# EAGLE design chipdesign2018 (EAGLE 7.3.0)

## Sheet 1 of 2
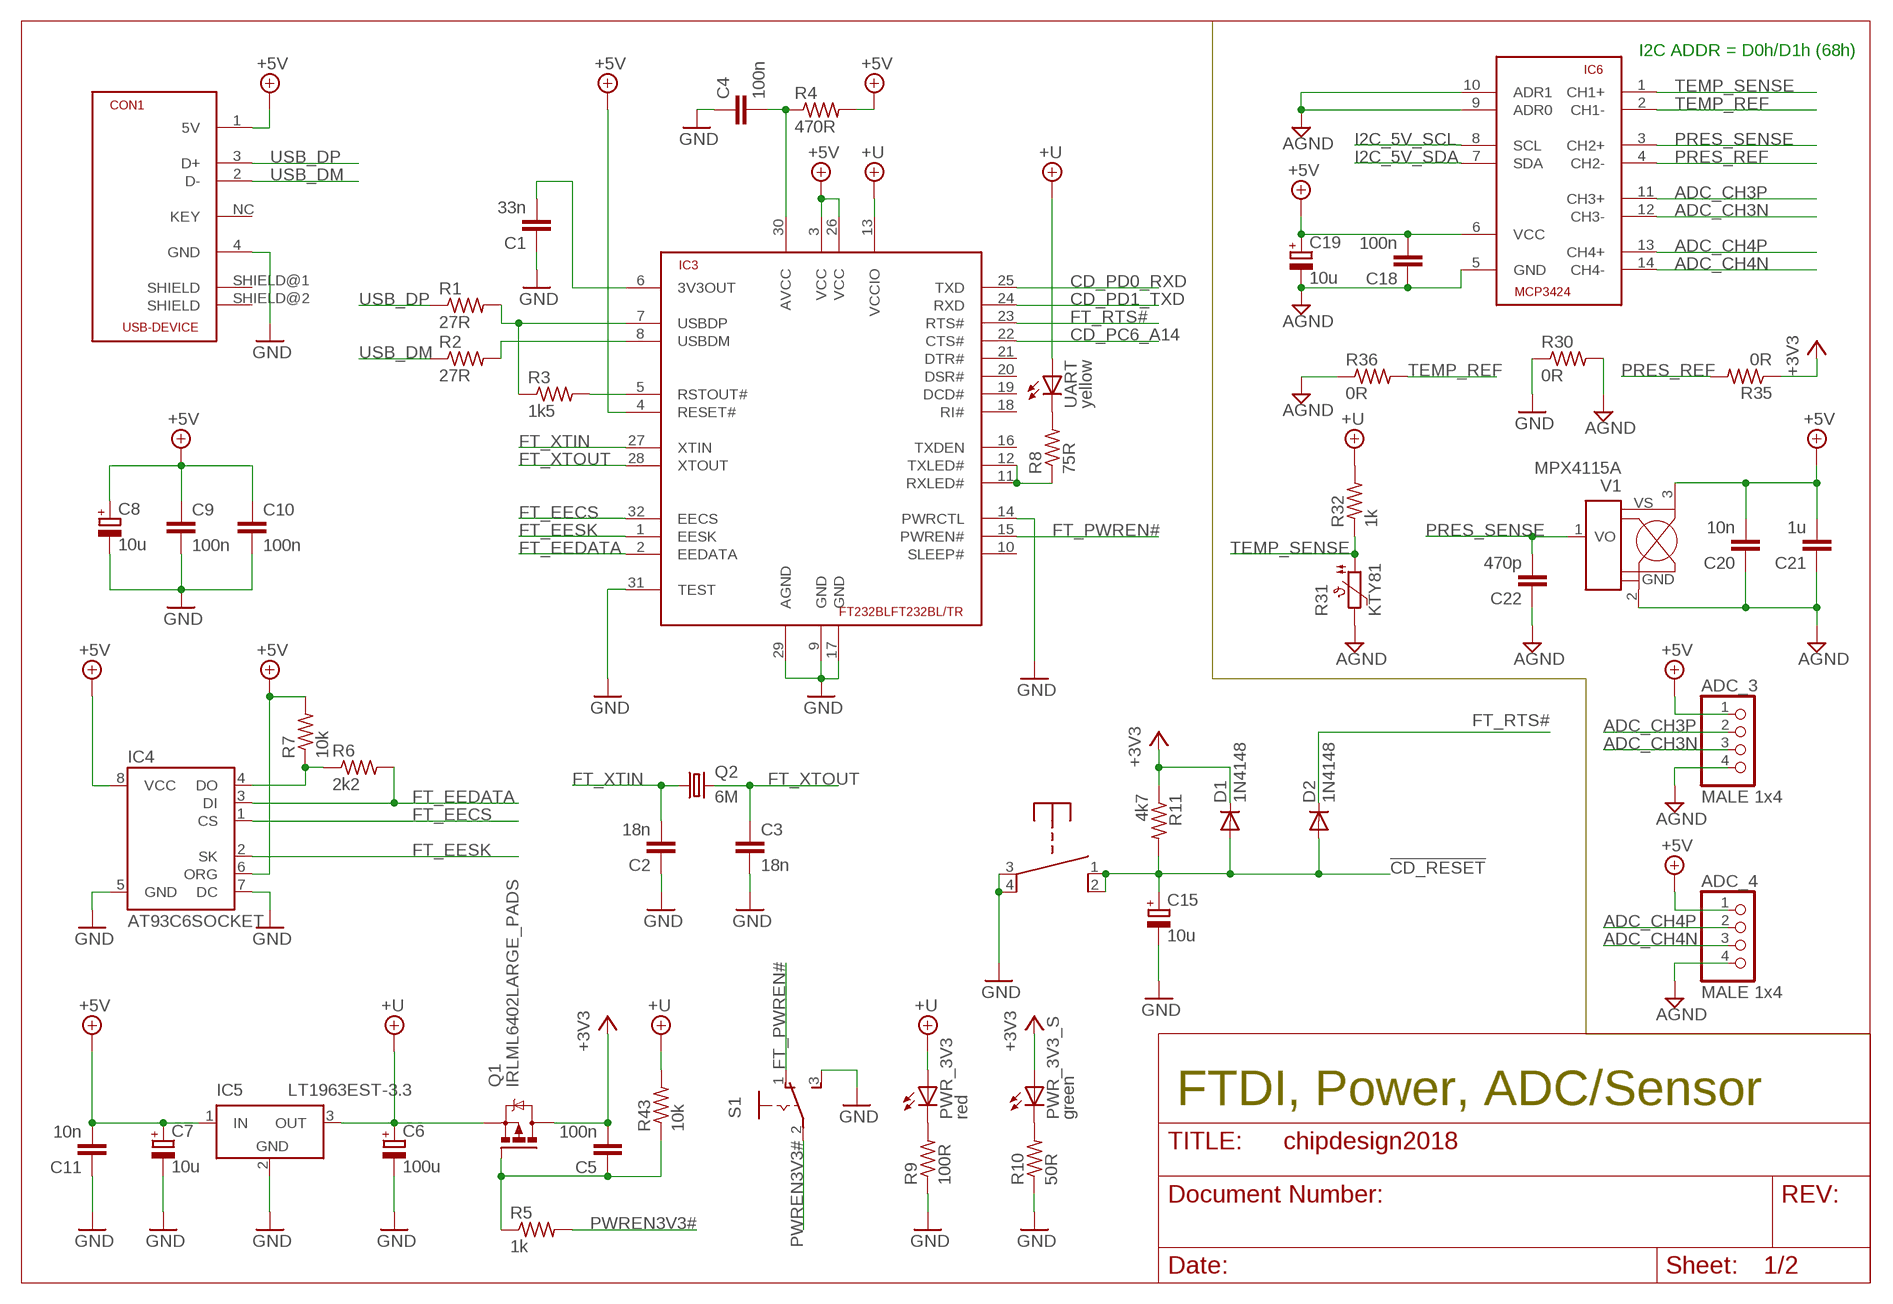
[diagram p0: schematic, sheet 1]

### Parts
ADC_3  MALE 1x4  PINHD-1X4  [1X04]
ADC_4  MALE 1x4  PINHD-1X4  [1X04]
C1  33n  C-EU025-025X050  [C025-025X050]
C2  18n  C-EU025-025X050  [C025-025X050]
C3  18n  C-EU025-025X050  [C025-025X050]
C4  100n  C-EU025-025X050  [C025-025X050]
C5  100n  C-EU025-025X050  [C025-025X050]
C6  100u  CPOL-EUE2.5-6  [E2,5-6]
C7  10u  CPOL-EUE2-5  [E2-5]
C8  10u  CPOL-EUE2-5  [E2-5]
C9  100n  C-EU025-025X050  [C025-025X050]
C10  100n  C-EU025-025X050  [C025-025X050]
C11  10n  C-EU025-025X050  [C025-025X050]
C15  10u  CPOL-EUE2-5  [E2-5]
C18  100n  C-EU025-025X050  [C025-025X050]
C19  10u  CPOL-EUE2-5  [E2-5]
C20  10n  C-EU025-025X050  [C025-025X050]
C21  1u  C-EU025-025X050  [C025-025X050]
C22  470p  C-EU025-025X050  [C025-025X050]
CON1  USB-DEVICE  [USB-B]
D1  1N4148  1N4148DO35-7  [DO35-7]
D2  1N4148  1N4148DO35-7  [DO35-7]
IC3  FT232BLFT232BL/TR  [LQFP-32]
IC4  AT93C6SOCKET  [SOCKET-08]
IC5  LT1963EST-3.3  [SOT223]
IC6  MCP3424  [SO-14]
PWR_3V3  red  LED3MM  [LED3MM]
PWR_3V3_S  green  LED3MM  [LED3MM]
Q1  IRLML6402LARGE_PADS  [SOT23W_INFINEON]
Q2  6M  CRYSTALHC49S  [HC49/S]
R1  27R  R-US_0207/7  [0207/7]
R2  27R  R-US_0207/7  [0207/7]
R3  1k5  R-US_0207/7  [0207/7]
R4  470R  R-US_0207/7  [0207/7]
R5  1k  R-US_0207/7  [0207/7]
R6  2k2  R-US_0207/7  [0207/7]
R7  10k  R-US_0207/7  [0207/7]
R8  75R  R-US_0207/7  [0207/7]
R9  100R  R-US_0207/7  [0207/7]
R10  50R  R-US_0207/7  [0207/7]
R11  4k7  R-US_0207/7  [0207/7]
R30  0R  R-US_0207/7  [0207/7]
R31  KTY81  PTC-SOD70  [SOD70]
R32  1k  R-US_0207/7  [0207/7]
R35  0R  R-US_0207/7  [0207/7]
R36  0R  R-US_0207/7  [0207/7]
R43  10k  R-US_0207/7  [0207/7]
S1  255SB  [255SB]
U$1  PHAP3301  [PHAP3301]
UART  yellow  LED3MM  [LED3MM]
V1  MPX4115A  MPX4250A  [MPX_CASE867]

### Nets
!CD_RESET: C15.+ D1.A D2.A R11.2 U$1.1 U$1.2 ; also sheet 2
+3V3: C5.2 D1.C PWR_3V3_S.A Q1.3(D) R11.1 R35.1 ; also sheet 2
+5V: ADC_3.1 ADC_4.1 C7.+ C8.+ C9.1 C10.1 C11.2 C18.2 C19.+ C20.2 C21.2 CON1.1(5V) IC3.3(VCC) IC3.4(RESET#) IC3.26(VCC) IC4.6(ORG) IC4.8(VCC) IC5.1(IN) IC6.6(VCC) R4.2 R7.2 V1.3(VS) ; also sheet 2
+UB: C6.+ IC3.13(VCCIO) IC5.3(OUT) PWR_3V3.A Q1.2(S) R32.2 R43.2 UART.A ; supply symbol labelled +U
ADC_CH3N: ADC_3.3 IC6.12(CH3-)
ADC_CH3P: ADC_3.2 IC6.11(CH3+)
ADC_CH4N: ADC_4.3 IC6.14(CH4-)
ADC_CH4P: ADC_4.2 IC6.13(CH4+)
AGND: ADC_3.4 ADC_4.4 C18.1 C19.- C20.1 C21.1 C22.1 IC6.5(GND) IC6.9(ADR0) IC6.10(ADR1) R30.2 R31.2 R36.1 V1.2(GND)
CD_PC6_A14: IC3.22(CTS#) ; also sheet 2
CD_PD0_RXD: IC3.25(TXD) ; also sheet 2
CD_PD1_TXD: IC3.24(RXD) ; also sheet 2
EEDO: IC4.4(DO) R6.1 R7.1
EN3V3#: C5.1 Q1.1(G) R5.1 R43.1
FT_3V3OUT: C1.2 IC3.6(3V3OUT)
FT_ACTLED#: IC3.11(RXLED#) IC3.12(TXLED#) R8.1
FT_AVCC: C4.2 IC3.30(AVCC) R4.1
FT_EECS: IC3.32(EECS) IC4.1(CS)
FT_EEDATA: IC3.2(EEDATA) IC4.3(DI) R6.2
FT_EESK: IC3.1(EESK) IC4.2(SK)
FT_PWREN#: IC3.15(PWREN#) S1.1(O)
FT_RSTOUT#: IC3.5(RSTOUT#) R3.2
FT_RTS#: D2.C IC3.23(RTS#)
FT_USBDM: IC3.8(USBDM) R2.2
FT_USBDP: IC3.7(USBDP) R1.2 R3.1
FT_XTIN: C2.2 IC3.27(XTIN) Q2.1
FT_XTOUT: C3.1 IC3.28(XTOUT) Q2.2
GND: C1.1 C2.1 C3.2 C4.1 C6.- C7.- C8.- C9.2 C10.2 C11.1 C15.- CON1.4(GND) IC3.9(GND) IC3.14(PWRCTL) IC3.17(GND) IC3.29(AGND) IC3.31(TEST) IC4.5(GND) IC4.7(DC) IC5.2(GND) R9.1 R10.1 R30.1 S1.3(S) U$1.3 U$1.4 ; also sheet 2
I2C_5V_SCL: IC6.8(SCL) ; also sheet 2
I2C_5V_SDA: IC6.7(SDA) ; also sheet 2
N$3: R8.2 UART.K(C)
N$4: PWR_3V3.K(C) R9.2
N$5: PWR_3V3_S.K(C) R10.2
PRES_REF: IC6.4(CH2-) R35.2
PRES_SENSE: C22.2 IC6.3(CH2+) V1.1(VO+)
PWREN3V3#: R5.2 S1.2(P)
TEMP_REF: IC6.2(CH1-) R36.2
TEMP_SENSE: IC6.1(CH1+) R31.1 R32.1
USB_DM: CON1.2(D-) R2.1
USB_DP: CON1.3(D+) R1.1
Unconnected: CON1.NC(KEY) CON1.SHIELD@1(SHIELD) CON1.SHIELD@2(SHIELD) IC3.10(SLEEP#) IC3.16(TXDEN) IC3.18(RI#) IC3.19(DCD#) IC3.20(DSR#) IC3.21(DTR#)

### Notes on the sheet
- I2C ADDR = D0h/D1h (68h)
- FTDI, Power, ADC/Sensor

## Sheet 2 of 2
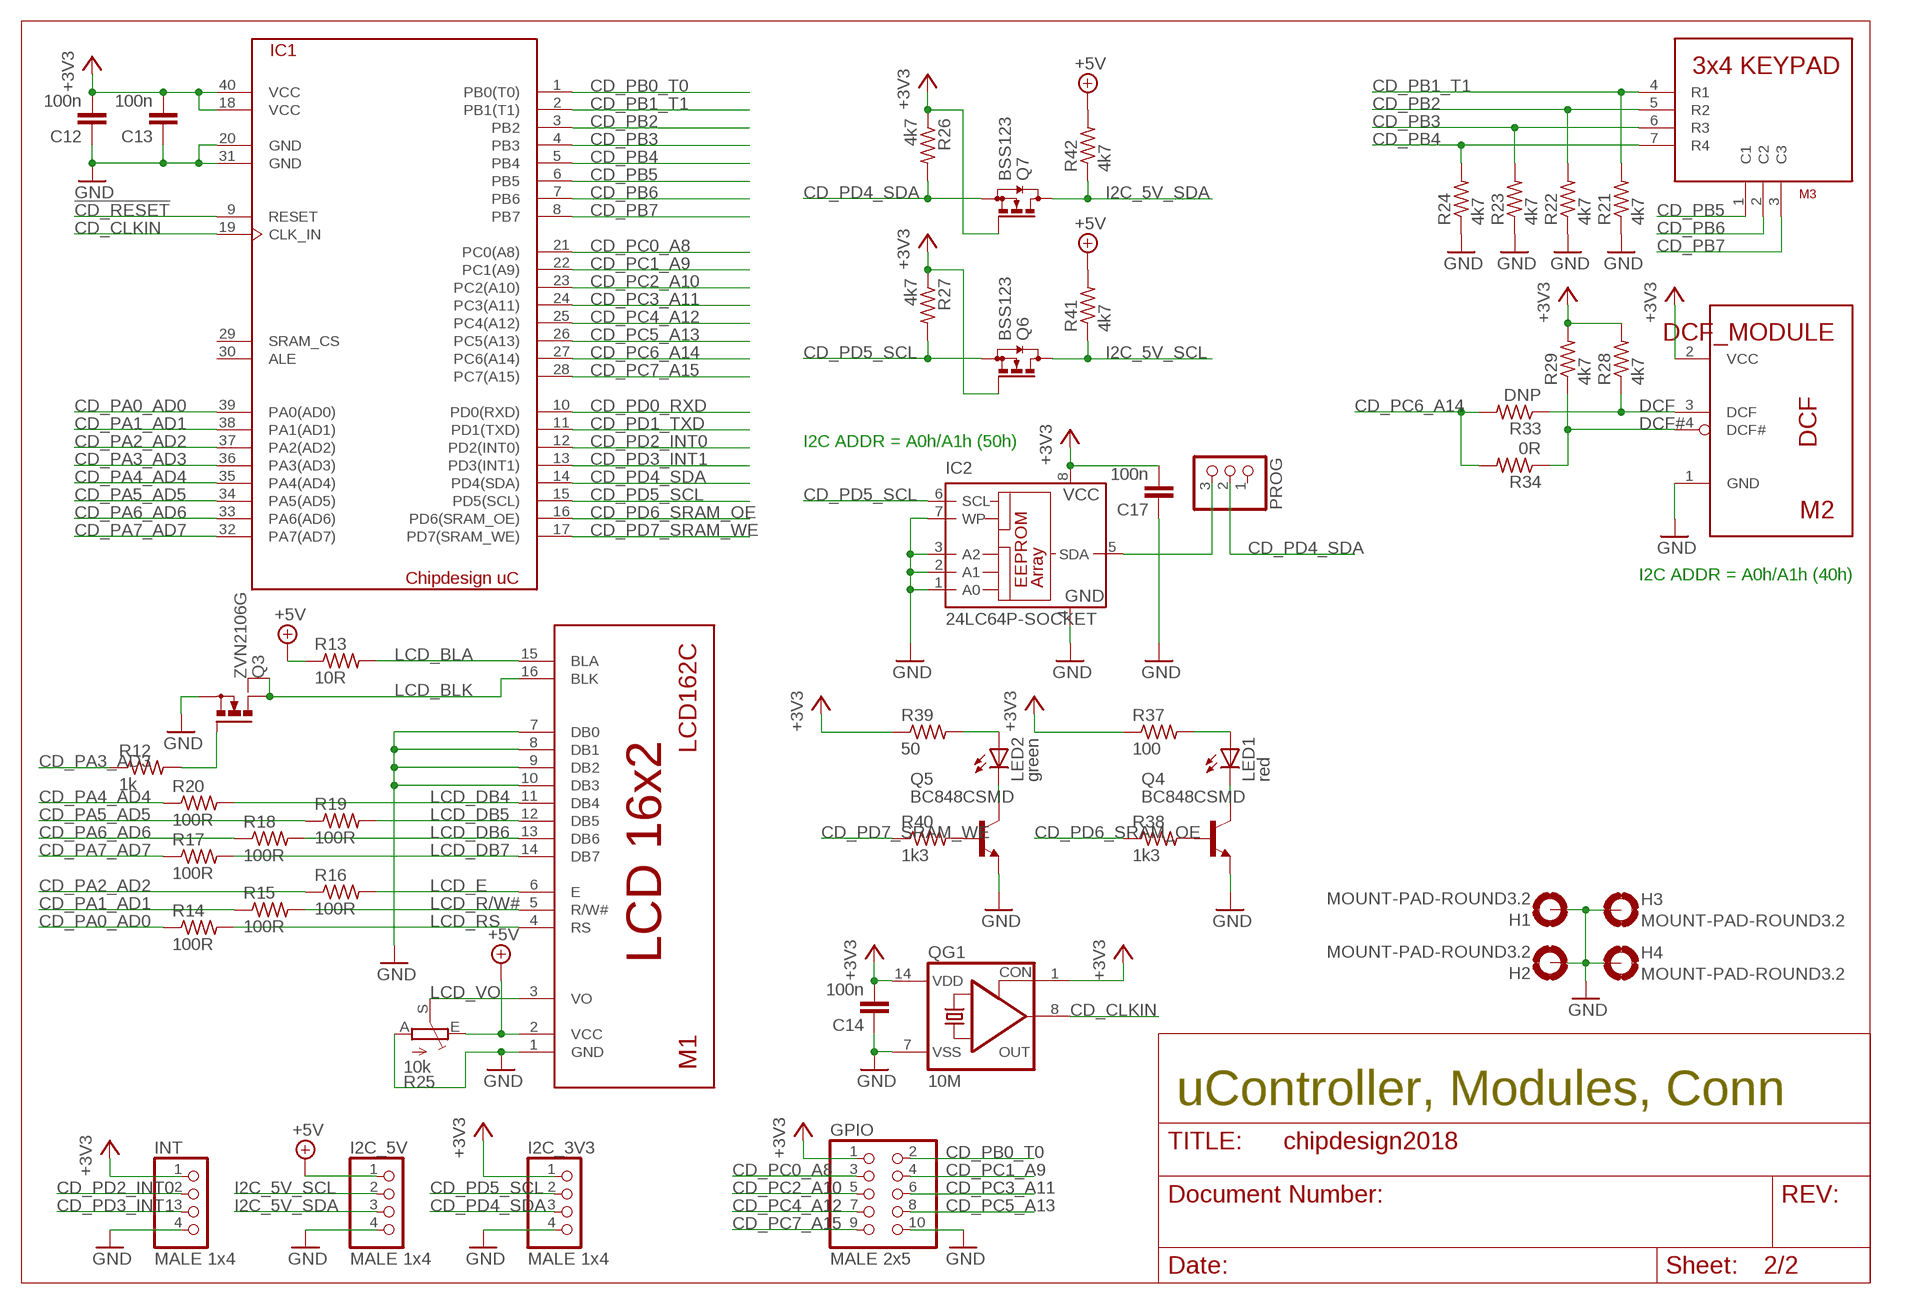
[diagram p1: schematic, sheet 2]

### Parts
C12  100n  C-EU025-025X050  [C025-025X050]
C13  100n  C-EU025-025X050  [C025-025X050]
C14  100n  C-EU025-025X050  [C025-025X050]
C17  100n  C-EU025-025X050  [C025-025X050]
GPIO  MALE 2x5  PINHD-2X5  [2X05]
H1  MOUNT-PAD-ROUND3.2  [3,2-PAD]
H2  MOUNT-PAD-ROUND3.2  [3,2-PAD]
H3  MOUNT-PAD-ROUND3.2  [3,2-PAD]
H4  MOUNT-PAD-ROUND3.2  [3,2-PAD]
I2C_3V3  MALE 1x4  PINHD-1X4  [1X04]
I2C_5V  MALE 1x4  PINHD-1X4  [1X04]
IC1  Chipdesign uC  CHIPDESIGN_UC  [FPGA-BOARD-2X20]
IC2  24LC64P-SOCKET  [SOCKET-08]
INT  MALE 1x4  PINHD-1X4  [1X04]
LED1  red  LED3MM  [LED3MM]
LED2  green  LED3MM  [LED3MM]
M1  LCD162C  [LCD162C]
M2  DCF_MODULE  [DCF_MODULE]
M3  KEYPAD  [KEYPAD]
PROG  PINHD-1X3  [1X03]
Q3  ZVN2106G  [SOT223]
Q4  BC848CSMD  [SOT23]
Q5  BC848CSMD  [SOT23]
Q6  BSS123  [SOT23]
Q7  BSS123  [SOT23]
QG1  10M  CRYSTAL_RES-SG51  [SG51]
R12  1k  R-US_0207/7  [0207/7]
R13  10R  R-US_0207/7  [0207/7]
R14  100R  R-US_0207/7  [0207/7]
R15  100R  R-US_0207/7  [0207/7]
R16  100R  R-US_0207/7  [0207/7]
R17  100R  R-US_0207/7  [0207/7]
R18  100R  R-US_0207/7  [0207/7]
R19  100R  R-US_0207/7  [0207/7]
R20  100R  R-US_0207/7  [0207/7]
R21  4k7  R-US_0207/7  [0207/7]
R22  4k7  R-US_0207/7  [0207/7]
R23  4k7  R-US_0207/7  [0207/7]
R24  4k7  R-US_0207/7  [0207/7]
R25  10k  TRIM_EU-  [ST6]
R26  4k7  R-US_0207/7  [0207/7]
R27  4k7  R-US_0207/7  [0207/7]
R28  4k7  R-US_0207/7  [0207/7]
R29  4k7  R-US_0207/7  [0207/7]
R33  DNP  R-US_0207/7  [0207/7]
R34  0R  R-US_0207/7  [0207/7]
R37  100  R-US_0207/7  [0207/7]
R38  1k3  R-US_0207/7  [0207/7]
R39  50  R-US_0207/7  [0207/7]
R40  1k3  R-US_0207/7  [0207/7]
R41  4k7  R-US_0207/7  [0207/7]
R42  4k7  R-US_0207/7  [0207/7]

### Nets
!CD_RESET: IC1.9(RESET) ; also sheet 1
+3V3: C12.2 C13.2 C14.2 C17.2 GPIO.1 I2C_3V3.1 IC1.18(VCC) IC1.40(VCC) IC2.8(VCC) INT.1 M2.2(VCC) Q6.1(G) Q7.1(G) QG1.1(CON) QG1.14(VDD) R26.1 R27.1 R28.2 R29.2 R37.1 R39.1 ; also sheet 1
+5V: I2C_5V.1 M1.2(VCC) R13.1 R25.E R41.2 R42.2 ; also sheet 1
CD_CLKIN: IC1.19(CLK_IN) QG1.8(OUT)
CD_PA0_AD0: IC1.39(PA0(AD0)) R14.1
CD_PA1_AD1: IC1.38(PA1(AD1)) R15.1
CD_PA2_AD2: IC1.37(PA2(AD2)) R16.1
CD_PA3_AD3: IC1.36(PA3(AD3)) R12.1
CD_PA4_AD4: IC1.35(PA4(AD4)) R20.1
CD_PA5_AD5: IC1.34(PA5(AD5)) R19.1
CD_PA6_AD6: IC1.33(PA6(AD6)) R18.1
CD_PA7_AD7: IC1.32(PA7(AD7)) R17.1
CD_PB0_T0: GPIO.2 IC1.1(PB0(T0))
CD_PB1_T1: IC1.2(PB1(T1)) M3.4(R1) R21.2
CD_PB2: IC1.3(PB2) M3.5(R2) R22.2
CD_PB3: IC1.4(PB3) M3.6(R3) R23.2
CD_PB4: IC1.5(PB4) M3.7(R4) R24.2
CD_PB5: IC1.6(PB5) M3.1(C1)
CD_PB6: IC1.7(PB6) M3.2(C2)
CD_PB7: IC1.8(PB7) M3.3(C3)
CD_PC0_A8: GPIO.3 IC1.21(PC0(A8))
CD_PC1_A9: GPIO.4 IC1.22(PC1(A9))
CD_PC2_A10: GPIO.5 IC1.23(PC2(A10))
CD_PC3_A11: GPIO.6 IC1.24(PC3(A11))
CD_PC4_A12: GPIO.7 IC1.25(PC4(A12))
CD_PC5_A13: GPIO.8 IC1.26(PC5(A13))
CD_PC6_A14: IC1.27(PC6(A14)) R33.2 R34.2 ; also sheet 1
CD_PC7_A15: GPIO.9 IC1.28(PC7(A15))
CD_PD0_RXD: IC1.10(PD0(RXD)) ; also sheet 1
CD_PD1_TXD: IC1.11(PD1(TXD)) ; also sheet 1
CD_PD2_INT0: IC1.12(PD2(INT0)) INT.2
CD_PD3_INT1: IC1.13(PD3(INT1)) INT.3
CD_PD4_SDA: I2C_3V3.3 IC1.14(PD4(SDA)) PROG.2 Q7.2(S) R26.2
CD_PD5_SCL: I2C_3V3.2 IC1.15(PD5(SCL)) IC2.6(SCL) Q6.2(S) R27.2
CD_PD6_SRAM_OE: IC1.16(PD6(SRAM_OE)) R38.1
CD_PD7_SRAM_WE: IC1.17(PD7(SRAM_WE)) R40.1
DCF: M2.3(DCF) R28.1 R33.1
DCF#: M2.4(DCF#) R29.1 R34.1
EEP_SDA: IC2.5(SDA) PROG.3
GND: C12.1 C13.1 C14.1 C17.1 GPIO.10 H1.B3,2(MOUNT) H2.B3,2(MOUNT) H3.B3,2(MOUNT) H4.B3,2(MOUNT) I2C_3V3.4 I2C_5V.4 IC1.20(GND) IC1.31(GND) IC2.1(A0) IC2.2(A1) IC2.3(A2) IC2.4(GND) IC2.7(WP) INT.4 M1.1(GND) M1.7(DB0) M1.8(DB1) M1.9(DB2) M1.10(DB3) M2.1(GND) Q3.3(S) Q4.2(E) Q5.2(E) QG1.7(VSS) R21.1 R22.1 R23.1 R24.1 R25.A ; also sheet 1
I2C_5V_SCL: I2C_5V.2 Q6.3(D) R41.1 ; also sheet 1
I2C_5V_SDA: I2C_5V.3 Q7.3(D) R42.1 ; also sheet 1
LCD_BLA: M1.15(BLA) R13.2
LCD_BLK: M1.16(BLK) Q3.2(D) Q3.4(D)
LCD_DB4: M1.11(DB4) R20.2
LCD_DB5: M1.12(DB5) R19.2
LCD_DB6: M1.13(DB6) R18.2
LCD_DB7: M1.14(DB7) R17.2
LCD_E: M1.6(E) R16.2
LCD_R/W#: M1.5(R/W#) R15.2
LCD_RS: M1.4(RS) R14.2
LCD_VO: M1.3(VO) R25.S
N$1: Q4.1(B) R38.2
N$2: LED1.K(C) Q4.3(C)
N$6: LED1.A R37.2
N$7: Q5.1(B) R40.2
N$8: Q3.1(G) R12.2
N$9: LED2.K(C) Q5.3(C)
N$10: LED2.A R39.2
Unconnected: IC1.29(SRAM_CS) IC1.30(ALE) PROG.1

### Notes on the sheet
- I2C ADDR = A0h/A1h (50h)
- I2C ADDR = A0h/A1h (40h)
- uController, Modules, Conn

## Power pins joined to a net without a drawn wire
GND: IC5.4(GND)

## Library data of the parts
ADC_3 ADC_4 I2C_3V3 I2C_5V INT = pinhead:PINHD-1X4: PIN HEADER
C1-C5 C9-C14 C17 C18 C20-C22 = rcl:C-EU: CAPACITOR, European symbol
C6-C8 C15 C19 = rcl:CPOL-EU: POLARIZED CAPACITOR, European symbol
CON1 = chipdesign2016_ref:USB-DEVICE
D1 D2 = diode:1N4148: DIODE high speed (Philips)
GPIO = pinhead:PINHD-2X5: PIN HEADER
H1-H4 = holes:MOUNT-PAD-ROUND: MOUNTING PAD, round
IC1 = chipdesign2016_ref:CHIPDESIGN_UC
IC2 = chipdesign2016_ref:24*: Serial EEPROM I2C; MF: MICROCHIP; MPN: 24LC64-I/P; OC_FARNELL: 9758054; OC_NEWARK: 62K0584
IC3 = chipdesign2016_ref:FT232BL
IC4 = chipdesign2016_ref:AT93C*6: 3-wire serial EEPROM
IC5 = linear-technology:LT1963EST: 1.5A, Low Noise, Fast Transient Response LDO Regulator Source: http://www.linear.com/pc/downloadDocument.do?navId=H0,C3,P2222,D3148; MPN: LT1963EST-3.3; OC_FARNELL: 1501032; OC_NEWARK: 57M7546
IC6 = chipdesign2016_ref:MCP3424
LED1 LED2 PWR_3V3 PWR_3V3_S UART = led:LED: LED OSRAM: - CHIPLED LG R971, LG N971, LY N971, LG Q971, LY Q971, LO R971, LY R971 LH N974, LH R974 LS Q976, LO Q976, LY Q976 LO Q996 - Hyper CHIPLED LW Q18S LB Q993, LB Q99A, LB R99A - SideLED LS A670, LO A670, LY A670, LG A670, LP A670 LB A673, LV A673, LT A673, LW A673 LH A674 LY A675 LS A676, LA A676, LO A676, LY A676, LW A676 LS A679, LY A679, LG A679 - Hyper Micro SIDELED® LS Y876, LA Y876, LO Y876, LY Y876 LT Y87S - SmartLED LW L88C, LW L88S LB L89C, LB L89S, LG L890 LS L89K, LO L89K, LY L89K LS L896, LA L896, LO L896, LY L896 - TOPLED LS T670, LO T670, LY T670, LG T670, LP T670 LSG T670, LSP T670, LSY T670, LOP T670, LYG T670 LG T671, LOG T671, LSG T671 LB T673, LV T673, LT T673, LW T673 LH T674 LS T676, LA T676, LO T676, LY T676, LB T676, LH T676, LSB T676, LW T676 LB T67C, LV T67C, LT T67C, LS T67K, LO T67K, LY T67K, LW E67C LS E67B, LA E67B, LO E67B, LY E67B, LB E67C, LV E67C, LT E67C LW T67C LS T679, LY T679, LG T679 LS T770, LO T770, LY T770, LG T770, LP T770 LB T773, LV T773, LT T773, LW T773 LH T774 LS E675, LA E675, LY E675, LS T675 LS T776, LA T776, LO T776, LY T776, LB T776 LHGB T686 LT T68C, LB T68C - Hyper Mini TOPLED® LB M676 - Mini TOPLED Santana® LG M470 LS M47K, LO M47K, LY M47K Source: http://www.osram.convergy.de LUXEON: - LUMILED® LXK2-PW12-R00, LXK2-PW12-S00, LXK2-PW14-U00, LXK2-PW14-V00 LXK2-PM12-R00, LXK2-PM12-S00, LXK2-PM14-U00 LXK2-PE12-Q00, LXK2-PE12-R00, LXK2-PE12-S00, LXK2-PE14-T00, LXK2-PE14-U00 LXK2-PB12-K00, LXK2-PB12-L00, LXK2-PB12-M00, LXK2-PB14-N00, LXK2-PB14-P00, LXK2-PB14-Q00 LXK2-PR12-L00, LXK2-PR12-M00, LXK2-PR14-Q00, LXK2-PR14-R00 LXK2-PD12-Q00, LXK2-PD12-R00, LXK2-PD12-S00 LXK2-PH12-R00, LXK2-PH12-S00 LXK2-PL12-P00, LXK2-PL12-Q00, LXK2-PL12-R00 Source: www.luxeon.com KINGBRIGHT: KA-3528ASYC Source: www.kingbright.com
M1 = chipdesign2016_ref:LCD162C
M2 = chipdesign2016_ref:DCF_MODULE
M3 = chipdesign2016_ref:KEYPAD
PROG = pinhead:PINHD-1X3: PIN HEADER
Q1 = chipdesign2016_ref:IRLML6402: HEXFET P-Channel Power MOSFET
Q2 = chipdesign2016_ref:CRYSTAL: CRYSTAL; OC_FARNELL: 1667008; OC_NEWARK: unknown
Q3 = chipdesign2016_ref:ZVN2106G: Power MOSFET N-Channel
Q4 Q5 = transistor-npn:BC848*: NPN Transistor
Q6 Q7 = transistor-small-signal:BSS123: N-CHANNEL MOS FET
QG1 = chipdesign2016_ref:CRYSTAL_RES-: CRYSTAL RESONATOR; OC_FARNELL: unknown; OC_NEWARK: unknown
R1-R24 R26-R30 R32-R43 = rcl:R-US_: RESISTOR, American symbol
R25 = chipdesign2016_ref:TRIM_EU-: POTENTIOMETER
R31 = chipdesign2016_ref:PTC-: Positive Temperature Coefficient Resistor (PTC) termistor Philips KTY81-210 - KTY81-252 Source: 153627-da-01-en-Temperatur-Sensor_KTY10-6_Philips.pdf; OC_FARNELL: unknown; OC_NEWARK: unknown
S1 = switch:255SB: SLIDING SWITCH Distributor Buerklin, 11G810
U$1 = chipdesign2016_ref:PHAP3301
V1 = chipdesign2016_ref:MPX4250A: 50 kPa Pressure Sensor On-Chip Temparetur Compensated & Calibrated Silicon Pressure Sensor

## Board
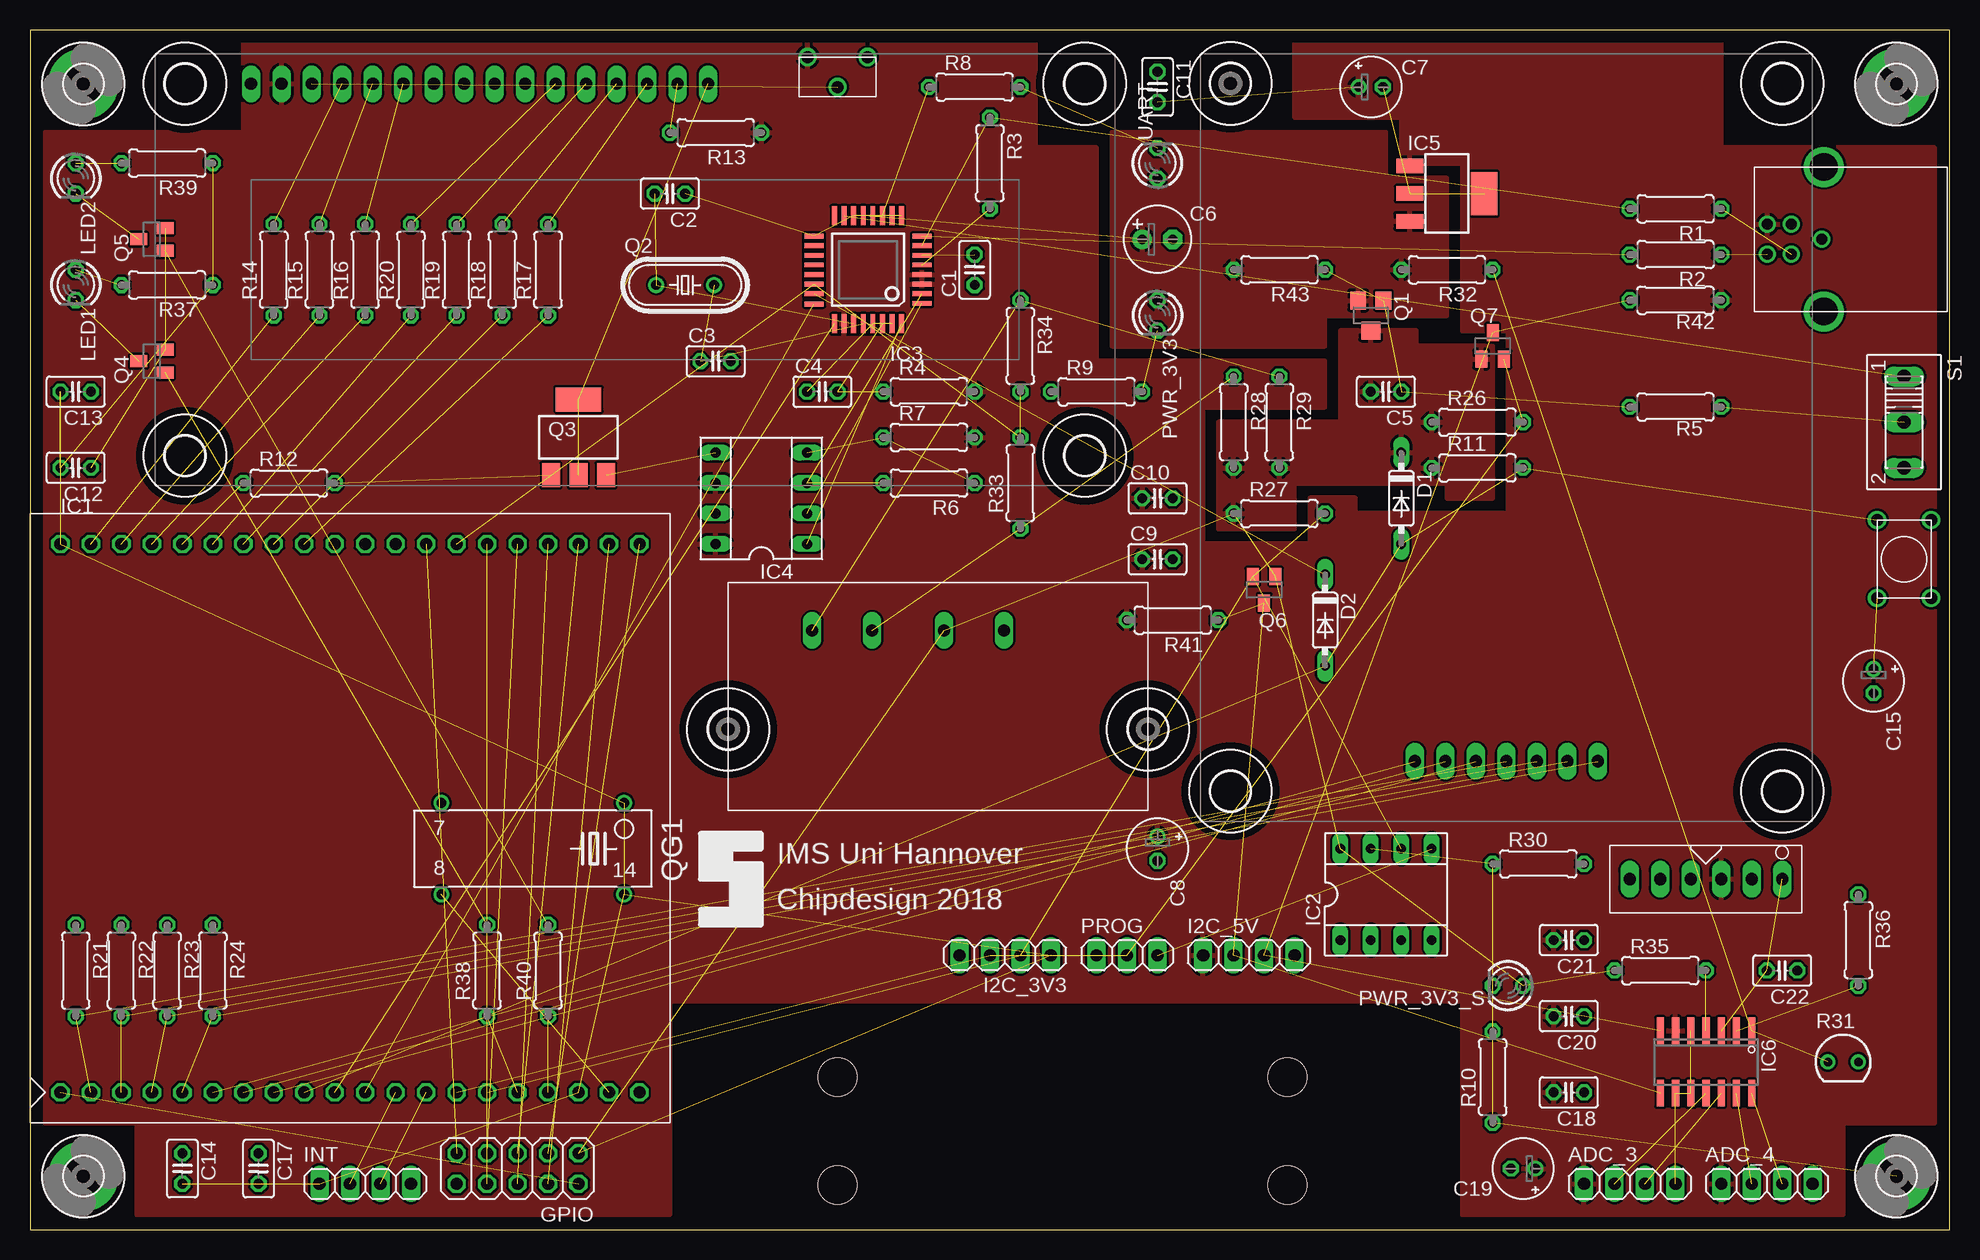
[diagram p2: board, top side]
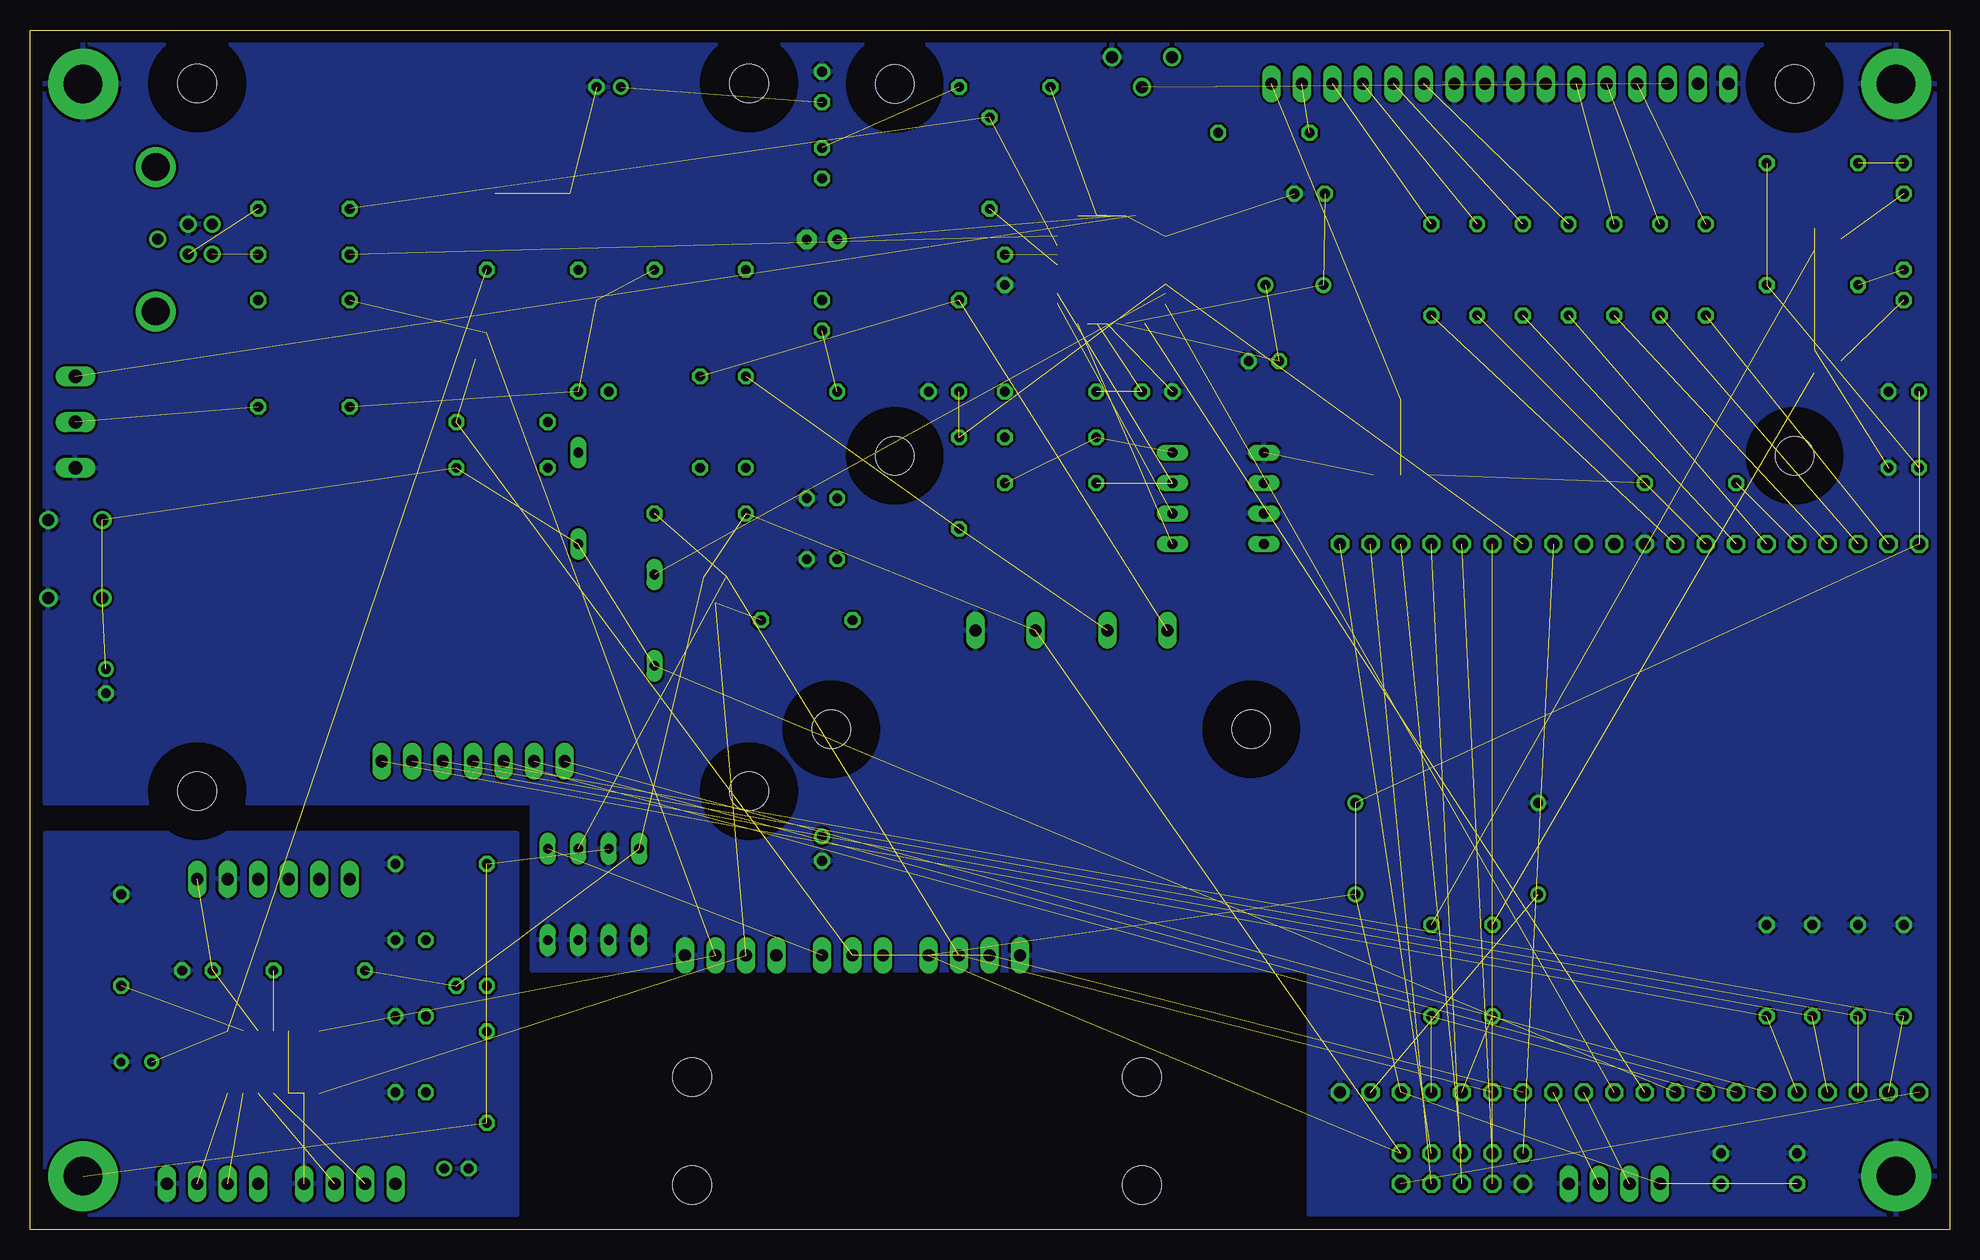
[diagram p3: board, bottom side, seen from below]

Size 160 x 100 mm. Coordinates in mm from the lower left corner, seen from the top.
Outline: 0,0 160,0 160,100 0,100 0,0
Copper layers (1*16): Top 0.035mm / dielectric 1.5mm / Bottom 0.035mm
Design rules "default": minimum track width 10mil, minimum drill 24mil, track to track 8mil, track to pad 8mil, pad to pad 8mil, via to via 8mil, smd to smd 8mil, copper to edge 40mil, drill to drill 8mil, minimum pad ring 10mil, minimum via ring 8mil, stop-mask expansion 4mil, vias tented up to drill 0mil, thermal gap 10mil
Holes 3.2 mm at 67.31,12.7 104.81,12.7 67.31,3.71 104.81,3.71
tKeepout: area 54.6,0 to 118.1,17.8
tRestrict: area 54.6,0 to 118.1,17.8

### Footprints (pad centres in the part's own frame; a part is rotated, then mirrored left to right if it is on the bottom)
1X04 = drill 1.016 long: 1 -3.81,0; 2 -1.27,0; 3 1.27,0; 4 3.81,0
C025-025X050 = drill 0.813 octagon: 1 -1.27,0; 2 1.27,0
E2,5-6 = drill 0.813 pad 1.6: + -1.27,0 | drill 0.813 pad 1.6 octagon: - 1.27,0
E2-5 = drill 0.813 pad 1.27: + -1.016,0 | drill 0.813 pad 1.27 octagon: - 1.016,0
USB-B = drill 0.92: 1 2,-1.25; 2 2,1.25; 3 0,1.25; 4 0,-1.25; NC -2.54,0 | drill 2.3: SHIELD@1 -2.71,6.02; SHIELD@2 -2.71,-6.02
DO35-7 = drill 0.813 long: A 3.81,0; C -3.81,0
2X05 = drill 1.016 octagon: 1 -5.08,-1.27; 2 -5.08,1.27; 3 -2.54,-1.27; 4 -2.54,1.27; 5 0,-1.27; 6 0,1.27; 7 2.54,-1.27; 8 2.54,1.27; 9 5.08,-1.27; 10 5.08,1.27
3,2-PAD = drill 3.2 pad 5.842: B3,2 0,0
FPGA-BOARD-2X20 = drill 1.016 octagon: 1 -25.4,-22.86; 2 -22.86,-22.86; 3 -20.32,-22.86; 4 -17.78,-22.86; 5 -15.24,-22.86; 6 -12.7,-22.86; 7 -10.16,-22.86; 8 -7.62,-22.86; 9 -5.08,-22.86; 10 -2.54,-22.86; 11 0,-22.86; 12 2.54,-22.86; 13 5.08,-22.86; 14 7.62,-22.86; 15 10.16,-22.86; 16 12.7,-22.86; 17 15.24,-22.86; 18 17.78,-22.86; 19 20.32,-22.86; 20 22.86,-22.86; 21 22.86,22.86; 22 20.32,22.86; 23 17.78,22.86; 24 15.24,22.86; 25 12.7,22.86; 26 10.16,22.86; 27 7.62,22.86; 28 5.08,22.86; 29 2.54,22.86; 30 0,22.86; 31 -2.54,22.86; 32 -5.08,22.86; 33 -7.62,22.86; 34 -10.16,22.86; 35 -12.7,22.86; 36 -15.24,22.86; 37 -17.78,22.86; 38 -20.32,22.86; 39 -22.86,22.86; 40 -25.4,22.86
SOCKET-08 = drill 0.813 long: 1 -3.81,-3.81; 2 -1.27,-3.81; 3 1.27,-3.81; 4 3.81,-3.81; 5 3.81,3.81; 6 1.27,3.81; 7 -1.27,3.81; 8 -3.81,3.81
LQFP-32 = smd 0.4 x 1.6: 1 -2.8,-4.5; 2 -2,-4.5; 3 -1.2,-4.5; 4 -0.4,-4.5; 5 0.4,-4.5; 6 1.2,-4.5; 7 2,-4.5; 8 2.8,-4.5; 17 2.8,4.5; 18 2,4.5; 19 1.2,4.5; 20 0.4,4.5; 21 -0.4,4.5; 22 -1.2,4.5; 23 -2,4.5; 24 -2.87,4.5 | smd 1.6 x 0.4: 9 4.5,-2.8; 10 4.5,-2; 11 4.5,-1.2; 12 4.5,-0.4; 13 4.5,0.4; 14 4.5,1.2; 15 4.5,2; 16 4.5,2.8; 25 -4.5,2.8; 26 -4.5,2; 27 -4.5,1.2; 28 -4.5,0.4; 29 -4.5,-0.4; 30 -4.5,-1.2; 31 -4.5,-2; 32 -4.5,-2.8
SOT223 = smd 1.219 x 2.235: 1 -2.311,-3.099; 2 0,-3.099; 3 2.311,-3.099 | smd 3.6 x 2.2: 4 0,3.099
SO-14 = smd 0.6 x 2.2: 1 -3.81,-2.6; 2 -2.54,-2.6; 3 -1.27,-2.6; 4 0,-2.6; 5 1.27,-2.6; 6 2.54,-2.6; 7 3.81,-2.6; 8 3.81,2.6; 9 2.54,2.6; 10 1.27,2.6; 11 0,2.6; 12 -1.27,2.6; 13 -2.54,2.6; 14 -3.81,2.6
LED3MM = drill 0.813 octagon: A -1.27,0; K 1.27,0
LCD162C = drill 1.016 long: 1 -32,15.5; 2 -29.46,15.5; 3 -26.92,15.5; 4 -24.38,15.5; 5 -21.84,15.5; 6 -19.3,15.5; 7 -16.76,15.5; 8 -14.22,15.5; 9 -11.68,15.5; 10 -9.14,15.5; 11 -6.6,15.5; 12 -4.06,15.5; 13 -1.52,15.5; 14 1.02,15.5; 15 3.56,15.5; 16 6.1,15.5 | hole 3.2: -37.5,15.5; -37.5,-15.5; 37.5,-15.5; 37.5,15.5
DCF_MODULE = drill 1.016 long: 1 -5.5,-5.5; 2 -0.5,-5.5; 3 5.5,-5.5; 4 10.5,-5.5 | hole 3.2: -17.5,2.75; 17.5,2.75
KEYPAD = drill 1.016 long: 1 -7.62,-27; 2 -5.08,-27; 3 -2.54,-27; 4 0,-27; 5 2.54,-27; 6 5.08,-27; 7 7.62,-27 | hole 3.2: -23,29.5; 23,29.5; -23,-29.5; 23,-29.5
1X03 = drill 1.016 long: 1 -2.54,0; 2 0,0; 3 2.54,0
SOT23W_INFINEON = smd 1.5 x 1.3: 1 -1.25,1.05; 2 -1.25,-1.05 | smd 1.5 x 1.6: 3 1.25,0
HC49/S = drill 0.813: 1 -2.413,0; 2 2.413,0
SOT223' = smd 1.5 x 2: 1 -2.3,-3.15; 2 0,-3.15; 3 2.3,-3.15 | smd 3.8 x 2: 4 0,3.15
SOT23 = smd 1 x 1.4: 1 -0.95,-1.1; 2 0.95,-1.1; 3 0,1.1
SG51 = drill 0.813: 1 -7.62,-3.81; 7 7.62,-3.81; 8 7.62,3.81; 14 -7.62,3.81
0207/7 = drill 0.813 octagon: 1 -3.81,0; 2 3.81,0
ST6 = drill 1: A 2.5,-2.5; E 2.5,2.5; S 0,0
SOD70 = drill 0.7 pad 1.27: 1 -1.27,0; 2 1.27,0
255SB = drill 1.118 long: 1 -3.81,0; 2 0,0; 3 3.81,0
PHAP3301 = drill 1: 1 -3.25,2.25; 2 3.25,2.25; 3 -3.25,-2.25; 4 3.25,-2.25
MPX_CASE867 = drill 1.016 long: 1 -6.35,0; 2 -3.81,0; 3 -1.27,0; 4 1.27,0; 5 3.81,0; 6 6.35,0

### Placement (x,y rotation side)
ADC_3  133.35,3.81 0 top
ADC_4  144.78,3.81 0 top
C1  78.74,80.01 90 top
C2  53.34,86.36 180 top
C3  57.15,72.39 0 top
C4  66.04,69.85 0 top
C5  113.03,69.85 180 top
C6  93.98,82.55 0 top
C7  111.76,95.25 0 top
C8  93.98,31.75 270 top
C9  93.98,55.88 0 top
C10  93.98,60.96 0 top
C11  93.98,95.25 270 top
C12  3.81,63.5 180 top
C13  3.81,69.85 180 top
C14  12.7,5.08 270 top
C15  153.67,45.72 270 top
C17  19.05,5.08 270 top
C18  128.27,11.43 180 top
C19  124.46,5.08 180 top
C20  128.27,17.78 180 top
C21  128.27,24.13 180 top
C22  146.05,21.59 180 top
CON1  146.81,82.55 180 top
D1  114.3,60.96 270 top
D2  107.95,50.8 270 top
GPIO  40.64,5.08 180 top
H1  155.57,95.5 0 top
H2  4.45,95.5 180 top
H3  4.45,4.45 0 top
H4  155.57,4.45 0 top
I2C_3V3  81.28,22.86 180 top
I2C_5V  101.6,22.86 0 top
IC1  27.94,34.29 0 top
IC2  113.03,27.94 0 top
IC3  69.85,80.01 90 top
IC4  60.96,60.96 90 top
IC5  118.11,86.36 270 top
IC6  139.7,13.97 180 top
INT  27.94,3.81 0 top
LED1  3.81,78.74 270 top
LED2  3.81,87.63 270 top
M1  50.42,80.01 0 top
M2  75.69,44.45 180 top
M3  123.06,66.04 0 top
PROG  91.44,22.86 0 top
PWR_3V3  93.98,76.2 270 top
PWR_3V3_S  123.19,20.32 180 top
Q1  111.76,76.2 270 top
Q2  54.61,78.74 0 top
Q3  ZVN2106G  [SOT223']  45.72,66.04 0 top
Q4  10.16,72.39 90 top
Q5  10.16,82.55 90 top
Q6  102.87,53.34 180 top
Q7  121.92,73.66 0 top
QG1  41.91,31.75 180 top
R1  137.16,85.09 180 top
R2  137.16,81.28 180 top
R3  80.01,88.9 270 top
R4  74.93,69.85 0 top
R5  137.16,68.58 0 top
R6  74.93,62.23 180 top
R7  74.93,66.04 0 top
R8  78.74,95.25 0 top
R9  88.9,69.85 0 top
R10  121.92,12.7 90 top
R11  120.65,63.5 0 top
R12  21.59,62.23 0 top
R13  57.15,91.44 180 top
R14  20.32,80.01 90 top
R15  24.13,80.01 90 top
R16  27.94,80.01 90 top
R17  43.18,80.01 90 top
R18  39.37,80.01 90 top
R19  35.56,80.01 90 top
R20  31.75,80.01 90 top
R21  3.81,21.59 270 top
R22  7.62,21.59 270 top
R23  11.43,21.59 270 top
R24  15.24,21.59 270 top
R25  67.31,95.25 90 top
R26  120.65,67.31 0 top
R27  104.14,59.69 0 top
R28  100.33,67.31 270 top
R29  104.14,67.31 270 top
R30  125.73,30.48 0 top
R31  151.13,13.97 0 top
R32  118.11,80.01 180 top
R33  82.55,62.23 90 top
R34  82.55,73.66 270 top
R35  135.89,21.59 0 top
R36  152.4,24.13 270 top
R37  11.43,78.74 180 top
R38  38.1,21.59 90 top
R39  11.43,88.9 180 top
R40  43.18,21.59 90 top
R41  95.25,50.8 180 top
R42  137.16,77.47 0 top
R43  104.14,80.01 180 top
S1  156.21,67.31 270 top
U$1  156.21,55.88 90 top
UART  93.98,88.9 90 top
V1  139.7,29.21 180 top

### Tracks (layer width: path | path; a pad name or v marks a point on that pad's centre or on a via)
!CD_RESET  (6 unrouted)
+3V3  (18 unrouted)
  pour Top: 99.06,58.42 105.41,58.42 105.41,62.23 118.11,62.23 118.11,60.96 121.92,60.96 121.92,73.66 115.57,73.66 115.57,74.93 109.22,74.93 109.22,67.31 99.06,67.31
+5V  (1 unrouted)
  pour Top: 1.27,91.44 1.27,8.89 8.89,8.89 8.89,1.27 53.34,1.27 53.34,19.05 119.38,19.05 119.38,1.27 151.13,1.27 151.13,8.89 158.75,8.89 158.75,90.17 140.97,90.17 140.97,99.06 105.41,99.06 105.41,92.71 114.3,92.71 114.3,88.9 119.38,88.9 119.38,74.93 123.19,74.93 123.19,59.69 110.49,59.69 110.49,60.96 106.68,60.96 106.68,57.15 97.79,57.15 97.79,68.58 107.95,68.58 107.95,72.39 88.9,72.39 88.9,90.17 83.82,90.17 83.82,99.06 17.78,99.06 17.78,91.44
+UB  (1 unrouted)
  pour Top: 90.17,91.44 90.17,73.66 107.95,73.66 107.95,76.2 111.76,76.2 118.11,76.2 118.11,87.63 113.03,87.63 113.03,91.44
ADC_CH3N  (1 unrouted)
ADC_CH3P  (1 unrouted)
ADC_CH4N  (1 unrouted)
ADC_CH4P  (1 unrouted)
AGND  (3 unrouted)
  pour Bottom: 119.38,1.27 119.38,33.02 158.75,33.02 158.75,1.27
CD_CLKIN  (1 unrouted)
CD_PA0_AD0  (1 unrouted)
CD_PA1_AD1  (1 unrouted)
CD_PA2_AD2  (1 unrouted)
CD_PA3_AD3  (1 unrouted)
CD_PA4_AD4  (1 unrouted)
CD_PA5_AD5  (1 unrouted)
CD_PA6_AD6  (1 unrouted)
CD_PA7_AD7  (1 unrouted)
CD_PB0_T0  (1 unrouted)
CD_PB1_T1  (2 unrouted)
CD_PB2  (2 unrouted)
CD_PB3  (2 unrouted)
CD_PB4  (2 unrouted)
CD_PB5  (1 unrouted)
CD_PB6  (1 unrouted)
CD_PB7  (1 unrouted)
CD_PC0_A8  (1 unrouted)
CD_PC1_A9  (1 unrouted)
CD_PC2_A10  (1 unrouted)
CD_PC3_A11  (1 unrouted)
CD_PC4_A12  (1 unrouted)
CD_PC5_A13  (1 unrouted)
CD_PC6_A14  (3 unrouted)
CD_PC7_A15  (1 unrouted)
CD_PD0_RXD  (1 unrouted)
CD_PD1_TXD  (1 unrouted)
CD_PD2_INT0  (1 unrouted)
CD_PD3_INT1  (1 unrouted)
CD_PD4_SDA  (4 unrouted)
CD_PD5_SCL  (4 unrouted)
CD_PD6_SRAM_OE  (1 unrouted)
CD_PD7_SRAM_WE  (1 unrouted)
DCF  (2 unrouted)
DCF#  (2 unrouted)
EEDO  (2 unrouted)
EEP_SDA  (1 unrouted)
EN3V3#  (3 unrouted)
FT_3V3OUT  (1 unrouted)
FT_ACTLED#  (2 unrouted)
FT_AVCC  (2 unrouted)
FT_EECS  (1 unrouted)
FT_EEDATA  (2 unrouted)
FT_EESK  (1 unrouted)
FT_PWREN#  (1 unrouted)
FT_RSTOUT#  (1 unrouted)
FT_RTS#  (1 unrouted)
FT_USBDM  (1 unrouted)
FT_USBDP  (2 unrouted)
FT_XTIN  (2 unrouted)
FT_XTOUT  (2 unrouted)
GND  (13 unrouted)
  pour Bottom: 1.27,1.27 53.34,1.27 53.34,21.59 118.11,21.59 118.11,35.56 158.75,35.56 158.75,99.06 1.27,99.06
I2C_5V_SCL  (3 unrouted)
I2C_5V_SDA  (3 unrouted)
LCD_BLA  (1 unrouted)
LCD_BLK  (2 unrouted)
LCD_DB4  (1 unrouted)
LCD_DB5  (1 unrouted)
LCD_DB6  (1 unrouted)
LCD_DB7  (1 unrouted)
LCD_E  (1 unrouted)
LCD_R/W#  (1 unrouted)
LCD_RS  (1 unrouted)
LCD_VO  (1 unrouted)
N$1  (1 unrouted)
N$2  (1 unrouted)
N$3  (1 unrouted)
N$4  (1 unrouted)
N$5  (1 unrouted)
N$6  (1 unrouted)
N$7  (1 unrouted)
N$8  (1 unrouted)
N$9  (1 unrouted)
N$10  (1 unrouted)
PRES_REF  (1 unrouted)
PRES_SENSE  (2 unrouted)
PWREN3V3#  (1 unrouted)
TEMP_REF  (1 unrouted)
TEMP_SENSE  (2 unrouted)
USB_DM  (1 unrouted)
USB_DP  (1 unrouted)

### Text on the board
tNames: IMS Uni Hannover | Chipdesign 2018